# Altium project ALARA_V2_Rocketry_PCB.PrjPcb (part 2 of 2)
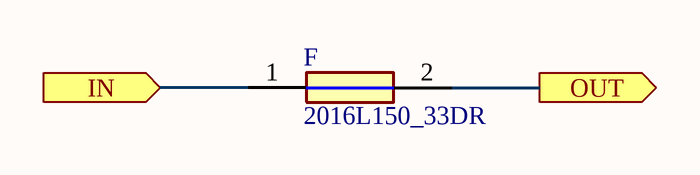
[diagram p12: PTC Fuse.SchDoc]

## Nets that join several sheets
3.3V: Sheet1 (63 pins), N1 (5 pins), N2 (5 pins), N3 (5 pins), N4 (5 pins), N5 (5 pins), N6 (5 pins), N7 (5 pins), N8 (5 pins), CAN Bus (5 pins), J0 (JP_H_J0.1), J1 (JP_H_J1.1), J2 (JP_H_J2.1), J3 (JP_H_J3.1)
5V: Sheet1 (13 pins), CAN Bus (C5.2 CANF_T.3)
GND: Sheet1 (107 pins), N1 (FL_N1.4), N2 (FL_N2.4), N3 (FL_N3.4), N4 (FL_N4.4), N5 (FL_N5.4), N6 (FL_N6.4), N7 (FL_N7.4), N8 (FL_N8.4), H1 (7 pins), H2 (7 pins), H3 (7 pins), H4 (7 pins), H5 (7 pins), H6 (7 pins), H7 (7 pins), H8 (7 pins), H9 (7 pins), H10 (7 pins), O1 (OP_O1.2 OP_O1.4), O2 (OP_O2.2 OP_O2.4), O3 (OP_O3.2 OP_O3.4), O4 (OP_O4.2 OP_O4.4), O5 (OP_O5.2 OP_O5.4), O6 (OP_O6.2 OP_O6.4), O7 (OP_O7.2 OP_O7.4), O8 (OP_O8.2 OP_O8.4), O9 (OP_O9.2 OP_O9.4), O10 (OP_O10.2 OP_O10.4), F1 (C_F1.1 R2_F1.2), F2 (C_F2.1 R2_F2.2), F3 (C_F3.1 R2_F3.2), F4 (C_F4.1 R2_F4.2), F5 (C_F5.1 R2_F5.2), F6 (C_F6.1 R2_F6.2), F7 (C_F7.1 R2_F7.2), F8 (C_F8.1 R2_F8.2), CAN Bus (12 pins), J0 (JP_L_J0.2), J1 (JP_L_J1.2), J2 (JP_L_J2.2), J3 (JP_L_J3.2), L1 (R1_L1.1 R2_L1.2 R3_L1.2), L2 (R1_L2.1 R2_L2.2 R3_L2.2)
A BLU1: Sheet1 (MCU.63), L1 (D_L1.4)
A BLU2: Sheet1 (MCU.11), L2 (D_L2.4)
A GRN1: Sheet1 (MCU.62), L1 (D_L1.5)
A GRN2: Sheet1 (MCU.10), L2 (D_L2.5)
A RED1: Sheet1 (MCU.61), L1 (D_L1.6)
A RED2: Sheet1 (MCU.9), L2 (D_L2.6)
ADDR0: Sheet1 (MCU.117), J0 (JP_H_J0.2 JP_L_J0.1)
ADDR1: Sheet1 (MCU.118), J1 (JP_H_J1.2 JP_L_J1.1)
ADDR2: Sheet1 (MCU.119), J2 (JP_H_J2.2 JP_L_J2.1)
ADDR3: Sheet1 (MCU.120), J3 (JP_H_J3.2 JP_L_J3.1)
AIN1: Sheet1 (Secondary_Connector.1), F1 (R1_F1.1)
AIN2: Sheet1 (Secondary_Connector.3), F2 (R1_F2.1)
AIN3: Sheet1 (Secondary_Connector.4), F3 (R1_F3.1)
AIN4: Sheet1 (Secondary_Connector.6), F4 (R1_F4.1)
AIN5: Sheet1 (Secondary_Connector.7), F5 (R1_F5.1)
AIN6: Sheet1 (Secondary_Connector.9), F6 (R1_F6.1)
AIN7: Sheet1 (Secondary_Connector.10), F7 (R1_F7.1)
AIN8: Sheet1 (Secondary_Connector.12), F8 (R1_F8.1)
AOUT1: Sheet1 (MCU.92), F1 (C_F1.2 R1_F1.2 R2_F1.1)
AOUT2: Sheet1 (MCU.91), F2 (C_F2.2 R1_F2.2 R2_F2.1)
AOUT3: Sheet1 (MCU.46), F3 (C_F3.2 R1_F3.2 R2_F3.1)
AOUT4: Sheet1 (MCU.45), F4 (C_F4.2 R1_F4.2 R2_F4.1)
AOUT5: Sheet1 (MCU.39), F5 (C_F5.2 R1_F5.2 R2_F5.1)
AOUT6: Sheet1 (MCU.38), F6 (C_F6.2 R1_F6.2 R2_F6.1)
AOUT7: Sheet1 (MCU.30), F7 (C_F7.2 R1_F7.2 R2_F7.1)
AOUT8: Sheet1 (MCU.29), F8 (C_F8.2 R1_F8.2 R2_F8.1)
BAT+: Sheet1 (BUCK.1 C101.1 J1.1 R101.2), H1 (D1_H1.1 R3_H1.2 R4_H1.2 R7_H1.2), H2 (D1_H2.1 R3_H2.2 R4_H2.2 R7_H2.2), H3 (D1_H3.1 R3_H3.2 R4_H3.2 R7_H3.2), H4 (D1_H4.1 R3_H4.2 R4_H4.2 R7_H4.2), H5 (D1_H5.1 R3_H5.2 R4_H5.2 R7_H5.2), H6 (D1_H6.1 R3_H6.2 R4_H6.2 R7_H6.2), H7 (D1_H7.1 R3_H7.2 R4_H7.2 R7_H7.2), H8 (D1_H8.1 R3_H8.2 R4_H8.2 R7_H8.2), H9 (D1_H9.1 R3_H9.2 R4_H9.2 R7_H9.2), H10 (D1_H10.1 R3_H10.2 R4_H10.2 R7_H10.2), PTC1 (F_PTC1.1), PTC2 (F_PTC2.1), PTC3 (F_PTC3.1), PTC4 (F_PTC4.1), PTC5 (F_PTC5.1)
CAN CLKO: Sheet1 (MCU.87), CAN Bus (CANF_C.3)
CAN CS: Sheet1 (MCU.78), CAN Bus (CANF_C.13 R2.1)
CAN INTN: Sheet1 (MCU.80), CAN Bus (CANF_C.4)
CAN INTN0: Sheet1 (MCU.77), CAN Bus (CANF_C.9)
CAN INTN1: Sheet1 (MCU.79), CAN Bus (CANF_C.8)
CANFH: Sheet1 (JP1.2), CAN Bus (CANF_T.7 R1.1)
CANFL: Sheet1 (JP2.1), CAN Bus (CANF_T.6 R1.2)
HPO BAT+1: Sheet1 (Primary_Connector.2 Primary_Connector.4 Primary_Connector.27 Primary_Connector.29), PTC1 (F_PTC1.2)
HPO BAT+2: Sheet1 (Primary_Connector.6 Primary_Connector.8 Primary_Connector.31 Primary_Connector.33), PTC2 (F_PTC2.2)
HPO BAT+3: Sheet1 (Primary_Connector.10 Primary_Connector.12 Primary_Connector.35 Primary_Connector.37), PTC3 (F_PTC3.2)
HPO BAT+4: Sheet1 (Primary_Connector.14 Primary_Connector.16 Primary_Connector.39 Primary_Connector.41), PTC4 (F_PTC4.2)
HPO BAT+5: Sheet1 (Primary_Connector.18 Primary_Connector.20 Primary_Connector.43 Primary_Connector.45), PTC5 (F_PTC5.2)
HPO D1: Sheet1 (Primary_Connector.1 Primary_Connector.26), H1 (7 pins)
HPO D2: Sheet1 (Primary_Connector.3 Primary_Connector.28), H2 (7 pins)
HPO D3: Sheet1 (Primary_Connector.5 Primary_Connector.30), H3 (7 pins)
HPO D4: Sheet1 (Primary_Connector.7 Primary_Connector.32), H4 (7 pins)
HPO D5: Sheet1 (Primary_Connector.9 Primary_Connector.34), H5 (7 pins)
HPO D6: Sheet1 (Primary_Connector.11 Primary_Connector.36), H6 (7 pins)
HPO D7: Sheet1 (Primary_Connector.13 Primary_Connector.38), H7 (7 pins)
HPO D8: Sheet1 (Primary_Connector.15 Primary_Connector.40), H8 (7 pins)
HPO D9: Sheet1 (Primary_Connector.17 Primary_Connector.42), H9 (7 pins)
HPO D10: Sheet1 (Primary_Connector.19 Primary_Connector.44), H10 (7 pins)
HPO DIG1: Sheet1 (MCU.144), O1 (R2_O1.2)
HPO DIG2: Sheet1 (MCU.143), O2 (R2_O2.2)
HPO DIG3: Sheet1 (MCU.142), O3 (R2_O3.2)
HPO DIG4: Sheet1 (MCU.141), O4 (R2_O4.2)
HPO DIG5: Sheet1 (MCU.140), O5 (R2_O5.2)
HPO DIG6: Sheet1 (MCU.139), O6 (R2_O6.2)
HPO DIG7: Sheet1 (MCU.138), O7 (R2_O7.2)
HPO DIG8: Sheet1 (MCU.137), O8 (R2_O8.2)
HPO DIG9: Sheet1 (MCU.126), O9 (R2_O9.2)
HPO DIG10: Sheet1 (MCU.125), O10 (R2_O10.2)
HPO PWM1: Sheet1 (MCU.136), O1 (R1_O1.2)
HPO PWM2: Sheet1 (MCU.131), O2 (R1_O2.2)
HPO PWM3: Sheet1 (MCU.130), O3 (R1_O3.2)
HPO PWM4: Sheet1 (MCU.129), O4 (R1_O4.2)
HPO PWM5: Sheet1 (MCU.127), O5 (R1_O5.2)
HPO PWM6: Sheet1 (MCU.109), O6 (R1_O6.2)
HPO PWM7: Sheet1 (MCU.106), O7 (R1_O7.2)
HPO PWM8: Sheet1 (MCU.104), O8 (R1_O8.2)
HPO PWM9: Sheet1 (MCU.98), O9 (R1_O9.2)
HPO PWM10: Sheet1 (MCU.97), O10 (R1_O10.2)
HPO VD1: Sheet1 (MCU.133), H1 (C_H1.2 R8_H1.1 R9_H1.2)
HPO VD2: Sheet1 (MCU.132), H2 (C_H2.2 R8_H2.1 R9_H2.2)
HPO VD3: Sheet1 (MCU.128), H3 (C_H3.2 R8_H3.1 R9_H3.2)
HPO VD4: Sheet1 (MCU.116), H4 (C_H4.2 R8_H4.1 R9_H4.2)
HPO VD5: Sheet1 (MCU.115), H5 (C_H5.2 R8_H5.1 R9_H5.2)
HPO VD6: Sheet1 (MCU.114), H6 (C_H6.2 R8_H6.1 R9_H6.2)
HPO VD7: Sheet1 (MCU.113), H7 (C_H7.2 R8_H7.1 R9_H7.2)
HPO VD8: Sheet1 (MCU.105), H8 (C_H8.2 R8_H8.1 R9_H8.2)
HPO VD9: Sheet1 (MCU.103), H9 (C_H9.2 R8_H9.1 R9_H9.2)
HPO VD10: Sheet1 (MCU.86), H10 (C_H10.2 R8_H10.1 R9_H10.2)
MISO: Sheet1 (7 pins), N1 (FL_N1.2), N2 (FL_N2.2), N3 (FL_N3.2), N4 (FL_N4.2), N5 (FL_N5.2), N6 (FL_N6.2), N7 (FL_N7.2), N8 (FL_N8.2), CAN Bus (CANF_C.12)
MOSI: Sheet1 (6 pins), N1 (FL_N1.5), N2 (FL_N2.5), N3 (FL_N3.5), N4 (FL_N4.5), N5 (FL_N5.5), N6 (FL_N6.5), N7 (FL_N7.5), N8 (FL_N8.5), CAN Bus (CANF_C.11)
MUX B1: Sheet1 (MUX.4), N1 (FL_N1.1 R1_N1.2)
MUX B2: Sheet1 (MUX.3), N2 (FL_N2.1 R1_N2.2)
MUX B3: Sheet1 (MUX.2), N3 (FL_N3.1 R1_N3.2)
MUX B4: Sheet1 (MUX.1), N4 (FL_N4.1 R1_N4.2)
MUX B5: Sheet1 (MUX.15), N5 (FL_N5.1 R1_N5.2)
MUX B6: Sheet1 (MUX.14), N6 (FL_N6.1 R1_N6.2)
MUX B7: Sheet1 (MUX.13), N7 (FL_N7.1 R1_N7.2)
MUX B8: Sheet1 (MUX.12), N8 (FL_N8.1 R1_N8.2)
OP1H1: H1 (R4_H1.1), O1 (OP_O1.8)
OP1H2: H2 (R4_H2.1), O2 (OP_O2.8)
OP1H3: H3 (R4_H3.1), O3 (OP_O3.8)
OP1H4: H4 (R4_H4.1), O4 (OP_O4.8)
OP1H5: H5 (R4_H5.1), O5 (OP_O5.8)
OP1H6: H6 (R4_H6.1), O6 (OP_O6.8)
OP1H7: H7 (R4_H7.1), O7 (OP_O7.8)
OP1H8: H8 (R4_H8.1), O8 (OP_O8.8)
OP1H9: H9 (R4_H9.1), O9 (OP_O9.8)
OP1H10: H10 (R4_H10.1), O10 (OP_O10.8)
OP1L1: H1 (Q_H1.8 R6_H1.2), O1 (OP_O1.7)
OP1L2: H2 (Q_H2.8 R6_H2.2), O2 (OP_O2.7)
OP1L3: H3 (Q_H3.8 R6_H3.2), O3 (OP_O3.7)
OP1L4: H4 (Q_H4.8 R6_H4.2), O4 (OP_O4.7)
OP1L5: H5 (Q_H5.8 R6_H5.2), O5 (OP_O5.7)
OP1L6: H6 (Q_H6.8 R6_H6.2), O6 (OP_O6.7)
OP1L7: H7 (Q_H7.8 R6_H7.2), O7 (OP_O7.7)
OP1L8: H8 (Q_H8.8 R6_H8.2), O8 (OP_O8.7)
OP1L9: H9 (Q_H9.8 R6_H9.2), O9 (OP_O9.7)
OP1L10: H10 (Q_H10.8 R6_H10.2), O10 (OP_O10.7)
OP2H1: H1 (R3_H1.1), O1 (OP_O1.6)
OP2H2: H2 (R3_H2.1), O2 (OP_O2.6)
OP2H3: H3 (R3_H3.1), O3 (OP_O3.6)
OP2H4: H4 (R3_H4.1), O4 (OP_O4.6)
OP2H5: H5 (R3_H5.1), O5 (OP_O5.6)
OP2H6: H6 (R3_H6.1), O6 (OP_O6.6)
OP2H7: H7 (R3_H7.1), O7 (OP_O7.6)
OP2H8: H8 (R3_H8.1), O8 (OP_O8.6)
OP2H9: H9 (R3_H9.1), O9 (OP_O9.6)
OP2H10: H10 (R3_H10.1), O10 (OP_O10.6)
OP2L1: H1 (Q_H1.1 R5_H1.2), O1 (OP_O1.5)
OP2L2: H2 (Q_H2.1 R5_H2.2), O2 (OP_O2.5)
OP2L3: H3 (Q_H3.1 R5_H3.2), O3 (OP_O3.5)
OP2L4: H4 (Q_H4.1 R5_H4.2), O4 (OP_O4.5)
OP2L5: H5 (Q_H5.1 R5_H5.2), O5 (OP_O5.5)
OP2L6: H6 (Q_H6.1 R5_H6.2), O6 (OP_O6.5)
OP2L7: H7 (Q_H7.1 R5_H7.2), O7 (OP_O7.5)
OP2L8: H8 (Q_H8.1 R5_H8.2), O8 (OP_O8.5)
OP2L9: H9 (Q_H9.1 R5_H9.2), O9 (OP_O9.5)
OP2L10: H10 (Q_H10.1 R5_H10.2), O10 (OP_O10.5)
SCLK: Sheet1 (6 pins), N1 (FL_N1.6), N2 (FL_N2.6), N3 (FL_N3.6), N4 (FL_N4.6), N5 (FL_N5.6), N6 (FL_N6.6), N7 (FL_N7.6), N8 (FL_N8.6), CAN Bus (CANF_C.10)